# Altium schematic sheet fiber.SCHDOC
size B
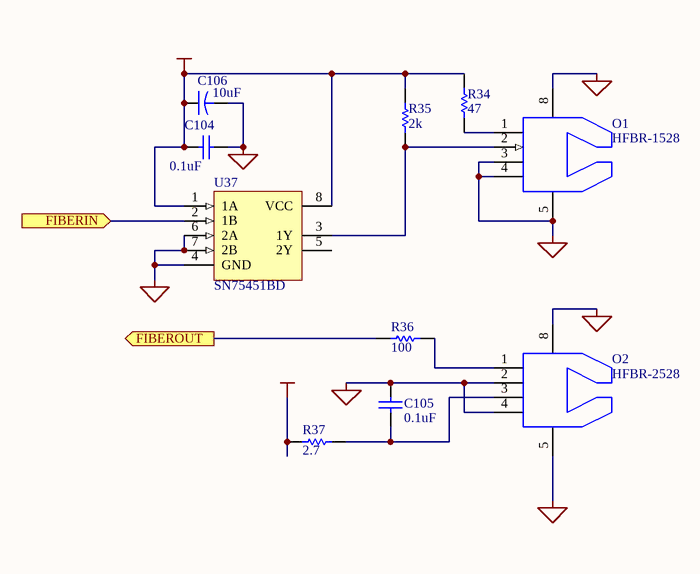
[diagram p0: fiber.SCHDOC]

## Parts
C104  value 0.1uF  [CC1608-0603]  (hidden comment: Cap)
C105  value 0.1uF  [CC1608-0603]  (hidden comment: Cap)
C106  value 10uF  [TC3528-1411]
O1  HFBR-1528  [HPVL]
O2  HFBR-2528  [HPVL]
R34  value 47  [R2012-0805]  (hidden comment: Res1)
R35  value 2k  [R2012-0805]  (hidden comment: Res1)
R36  value 100  [R2012-0805]  (hidden comment: Res1)
R37  value 2.7  [R2012-0805]  (hidden comment: Res1)
U37  SN75451BD  [SO-G8/E2.5]

## Ports
FIBERIN (in), FIBEROUT (out)

## Nets
+5VCC: C104.1 C106.1 R34.2 R35.2 R37.1 U37.1(1A) U37.8(VCC)
GND: C104.2 C105.2 C106.2 O1.3 O1.4 O1.5 O1.8 O2.2 O2.4 O2.5 O2.8 U37.4(GND) U37.6(2A) U37.7(2B)
FIBERIN: U37.2(1B) ; port FIBERIN
FIBEROUT: R36.1 ; port FIBEROUT
NetC105_1: C105.1 O2.3 R37.2
NetO1_1: O1.1 R34.1
NetO1_2: O1.2 R35.1 U37.3(1Y)
NetO2_1: O2.1 R36.2

Not connected (* = marked no-connect by the designer): U37 5(2Y)

## Library data of the parts
C104 C105 = Cap: Capacitor; Manufacturer: Generic Components; Class I: Passive; Published: 8-Jun-2000; Revision: July-2002: Re-released for DXP Platform.; Publisher: Altium Limited; Class II: Capacitor
C106 = Cap2: Capacitor; Manufacturer: Generic Components; Class I: Passive; Published: 23-Sep-2002; Publisher: Altium Limited; Class II: Capacitor
O1 = HFBR-1528: Low-cost fiber transmitter
O2 = HFBR-2528: Low-cost fiber receiver
R34-R37 = Res1: Resistor; Manufacturer: Generic Components; Class I: Passive; Published: 8-Jun-2000; Revision: July-2002: Re-released for DXP Platform.; Publisher: Altium Limited; Class II: Resistor
U37 = SN75451BD: Dual Peripheral Driver; Manufacturer: Texas Instruments; Package Information: Latest Revision: Jan-1998; Class I: Interface; Published: 15-May-2002; Datasheet: 1991 Interface Circuits Data Book (May-1990); Package Reference: D008; Publisher: Altium Limited; Class II: Peripheral Driver